# EAGLE design ControlPanel (EAGLE 9.6.2)
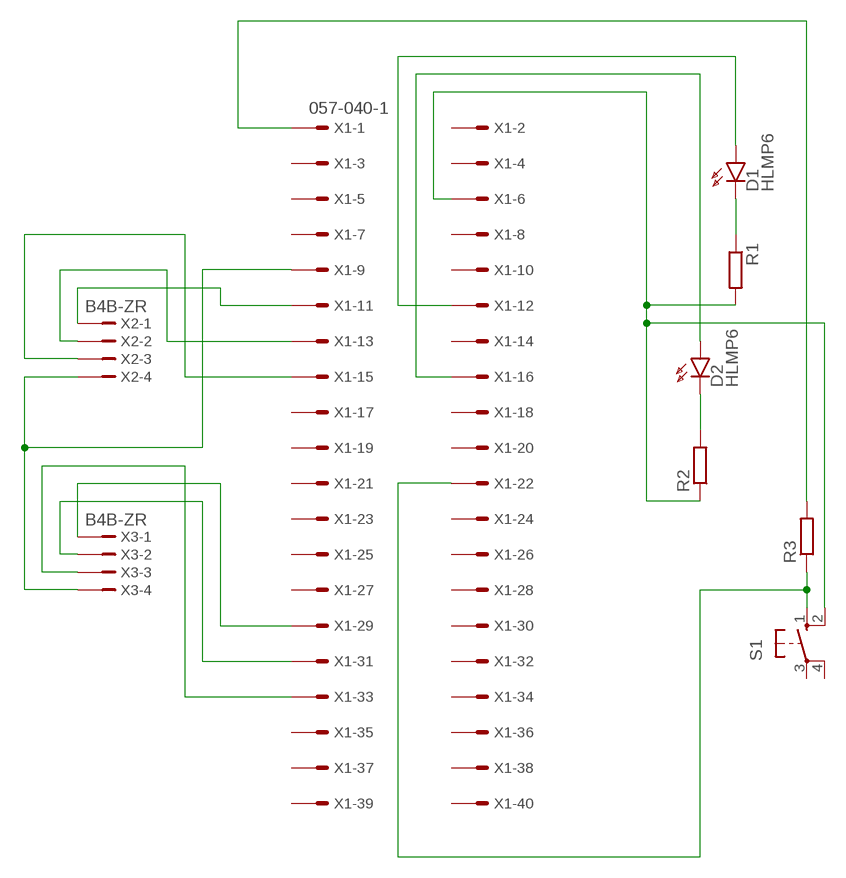
[diagram p0: schematic, sheet 1]

## Parts
D1  HLMP6  [HLMP6]
D2  HLMP6  [HLMP6]
R1  R-EU_0204/7  [0204/7]
R2  R-EU_0204/7  [0204/7]
R3  R-EU_0204/7  [0204/7]
S1  10-XX  [B3F-10XX]
X1  057-040-1  [057-040-1]
X2  B4B-ZR  [B4B-ZR]
X3  B4B-ZR  [B4B-ZR]

## Nets
N$1: D1.A X1.12
N$2: D2.A X1.16
N$3: D1.K R1.1
N$4: R1.2 R2.1 S1.2(S1) X1.6
N$5: D2.K R2.2
N$6: R3.2 X1.1
N$7: R3.1 S1.1(S) X1.22
N$8: X1.9 X2.4 X3.4
N$10: X1.11 X2.1
N$11: X1.13 X2.2
N$12: X1.15 X2.3
N$13: X1.29 X3.1
N$14: X1.31 X3.2
N$15: X1.33 X3.3
Unconnected: S1.3(P) S1.4(P1) X1.2 X1.3 X1.4 X1.5 X1.7 X1.8 X1.10 X1.14 X1.17 X1.18 X1.19 X1.20 X1.21 X1.23 X1.24 X1.25 X1.26 X1.27 X1.28 X1.30 X1.32 X1.34 X1.35 X1.36 X1.37 X1.38 X1.39 X1.40

## Library data of the parts
D1 D2 = display-hp:HLMP6: LED 2mm horizontal; MF: AGILENT TECHNOLOGIES; MPN: HLMP-6500; OC_FARNELL: 1652490; OC_NEWARK: 40K0088
R1-R3 = rcl:R-EU_: RESISTOR, European symbol; SPICEPREFIX: R
S1 = switch-omron:10-XX: OMRON SWITCH; MPN: B3F-1000; OC_FARNELL: 176432; OC_NEWARK: 36M3542
X1 = con-panduit:057-040-: CONNECTOR 40-pin series 057 contact pc board low profile headers; OC_FARNELL: unknown; OC_NEWARK: unknown
X2 X3 = con-jst:?4B-ZR: ZH CONNECTOR 1.5 mm, 4 pin 1 row Source: http://www.jst.com .. eZH.pdf; MF: FARNELL; MPN: B4B-ZR(LF)(SN); OC_FARNELL: 1830916; OC_NEWARK: 37K9960

## Board
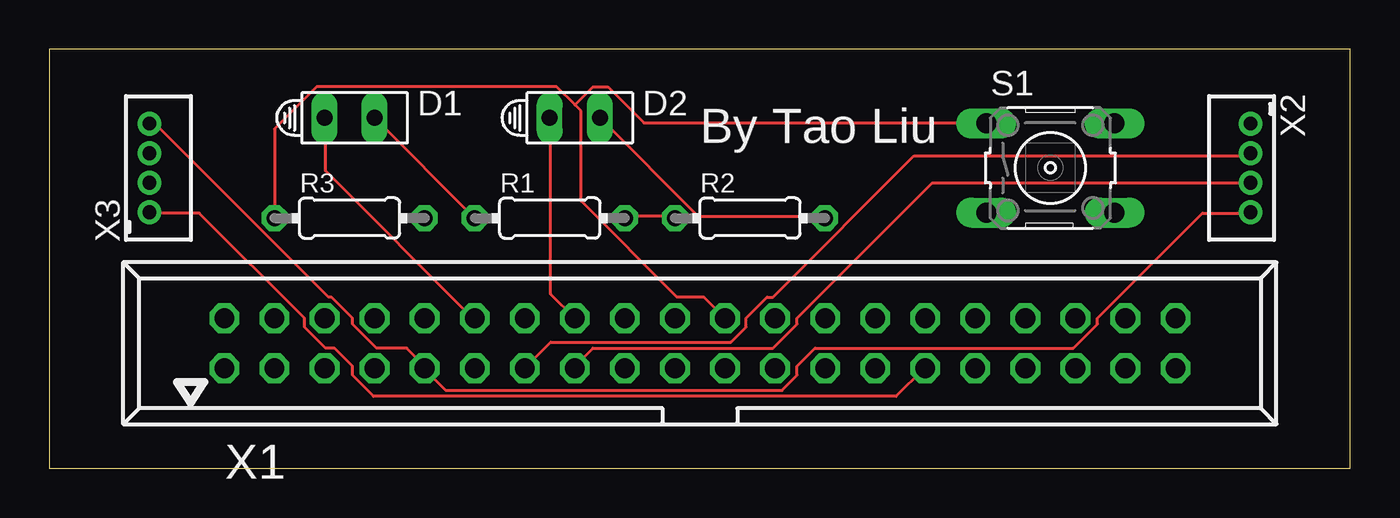
[diagram p1: board, top side]
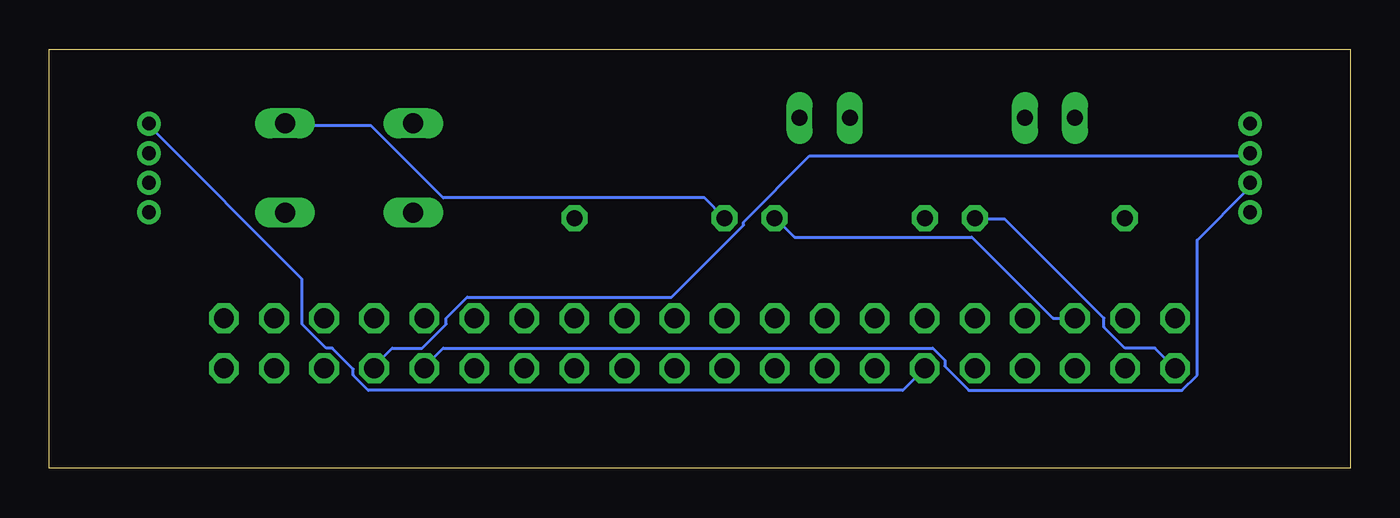
[diagram p2: board, bottom side, seen from below]

Size 66.02 x 21.26 mm. Coordinates in mm from the lower left corner, seen from the top.
Outline: 0,0 66.02,0 66.02,21.26 0,21.26 0,0
Copper layers (1*16): Top 0.035mm / dielectric 1.5mm / Bottom 0.035mm
Design rules "default": minimum track width 6mil, minimum drill 0.35mm, track to track 6mil, track to pad 6mil, pad to pad 6mil, via to via 6mil, smd to smd 6mil, copper to edge 40mil, drill to drill 6mil, minimum pad ring 10mil, minimum via ring 8mil, stop-mask expansion 4mil, vias tented up to drill 0mil, thermal gap 10mil

### Footprints (pad centres in the part's own frame; a part is rotated, then mirrored left to right if it is on the bottom)
HLMP6 = drill 0.813 long: A -1.27,0; K 1.27,0
0204/7 = drill 0.813 octagon: 1 -3.81,0; 2 3.81,0
B3F-10XX = drill 1.016 long: 1 -3.251,2.261; 2 3.251,2.261; 3 -3.251,-2.261; 4 3.251,-2.261
057-040-1 = drill 1 octagon: 1 -24.13,-1.27; 2 -24.13,1.27; 3 -21.59,-1.27; 4 -21.59,1.27; 5 -19.05,-1.27; 6 -19.05,1.27; 7 -16.51,-1.27; 8 -16.51,1.27; 9 -13.97,-1.27; 10 -13.97,1.27; 11 -11.43,-1.27; 12 -11.43,1.27; 13 -8.89,-1.27; 14 -8.89,1.27; 15 -6.35,-1.27; 16 -6.35,1.27; 17 -3.81,-1.27; 18 -3.81,1.27; 19 -1.27,-1.27; 20 -1.27,1.27; 21 1.27,-1.27; 22 1.27,1.27; 23 3.81,-1.27; 24 3.81,1.27; 25 6.35,-1.27; 26 6.35,1.27; 27 8.89,-1.27; 28 8.89,1.27; 29 11.43,-1.27; 30 11.43,1.27; 31 13.97,-1.27; 32 13.97,1.27; 33 16.51,-1.27; 34 16.51,1.27; 35 19.05,-1.27; 36 19.05,1.27; 37 21.59,-1.27; 38 21.59,1.27; 39 24.13,-1.27; 40 24.13,1.27
B4B-ZR = drill 0.7 pad 1.1: 1 -2.25,0; 2 -0.75,0; 3 0.75,0; 4 2.25,0

### Placement (x,y rotation side)
D1  15.24,17.78 0 top
D2  26.67,17.78 0 top
R1  25.4,12.7 0 top
R2  35.56,12.7 0 top
R3  15.24,12.7 0 top
S1  50.8,15.24 0 top
X1  33.02,6.35 0 top
X2  60.96,15.24 270 top
X3  5.08,15.24 90 top

### Tracks (layer width: path | path; a pad name or v marks a point on that pad's centre or on a via)
N$1
  Top 0.152: D1.A 14.02,17.68 14.02,15.09 21.49,7.62 X1.12
N$2
  Top 0.152: X1.16 25.45,8.84 25.45,17.68 D2.A
N$3
  Top 0.152: R1.1 D1.K
N$4
  Top 0.152: R1.2 29.26,12.8 31.7,12.8 R2.1
  Bottom 0.152: X1.6 15.09,7.62 19.2,11.73 28.19,11.73 29.11,12.65 R1.2 | R2.1 32.77,13.72 46.02,13.72 49.68,17.37 53.95,17.37 S1.2
N$5
  Top 0.152: D2.K 32.92,12.8 39.32,12.8 R2.2
N$6
  Bottom 0.152: X1.1 9.91,6.1 11.43,6.1 12.5,7.16 12.5,7.62 17.53,12.65 19.05,12.65 R3.2
N$7
  Top 0.152: R3.1 11.43,17.22 13.56,19.36 25.76,19.36 26.67,18.44 | 26.67,18.44 26.98,18.14 26.98,13.56 31.85,8.69 33.22,8.69 X1.22 | 26.67,18.44 27.58,19.36 28.35,19.36 30.18,17.53 47.55,17.53 S1.1
N$8
  Top 0.152: X2.4 60.96,12.95 58.52,12.95 53.19,7.62 53.19,7.32 51.97,6.1 38.86,6.1 37.95,5.18 37.95,4.72 37.19,3.96 20.12,3.96 19.05,5.03 X1.9 19.05,5.18 18.14,6.1 16.61,6.1 15.39,7.32 15.39,7.62 14.33,8.69 14.17,8.69 5.49,17.37 5.18,17.37 X3.4
N$10
  Bottom 0.152: X1.11 22.71,3.96 49.84,3.96 50.6,4.72 50.6,5.03 51.66,6.1 51.97,6.1 53.19,7.32 53.19,9.6 60.96,17.37 X2.1
N$11
  Top 0.152: X1.13 25.45,6.4 34.59,6.4 35.36,7.16 35.36,7.62 36.42,8.69 36.73,8.69 43.89,15.85 60.96,15.85 X2.2
N$12
  Top 0.152: X2.3 60.96,14.48 44.81,14.48 37.95,7.62 37.95,7.32 36.73,6.1 27.58,6.1 26.67,5.18 X1.15
N$13
  Top 0.152: X3.1 5.18,12.95 7.62,12.95 12.95,7.62 12.95,7.16 14.02,6.1 14.48,6.1 15.39,5.18 15.39,4.72 16.46,3.66 42.98,3.66 44.35,5.03 X1.29
N$14
  Bottom 0.152: X3.2 5.18,14.48 5.18,14.17 7.77,11.58 7.77,4.72 8.53,3.96 19.36,3.96 20.57,5.18 20.57,5.49 21.18,6.1 46.02,6.1 46.94,5.18 X1.31
N$15
  Bottom 0.152: X3.3 5.18,15.85 27.43,15.85 30.79,12.5 30.79,12.34 34.44,8.69 44.81,8.69 45.87,7.62 45.87,7.32 47.09,6.1 48.62,6.1 49.53,5.18 X1.33

### Text on the board
tNames: By Tao Liu